# Altium schematic sheet AutomaticDeGenerator.SchDoc
size Letter
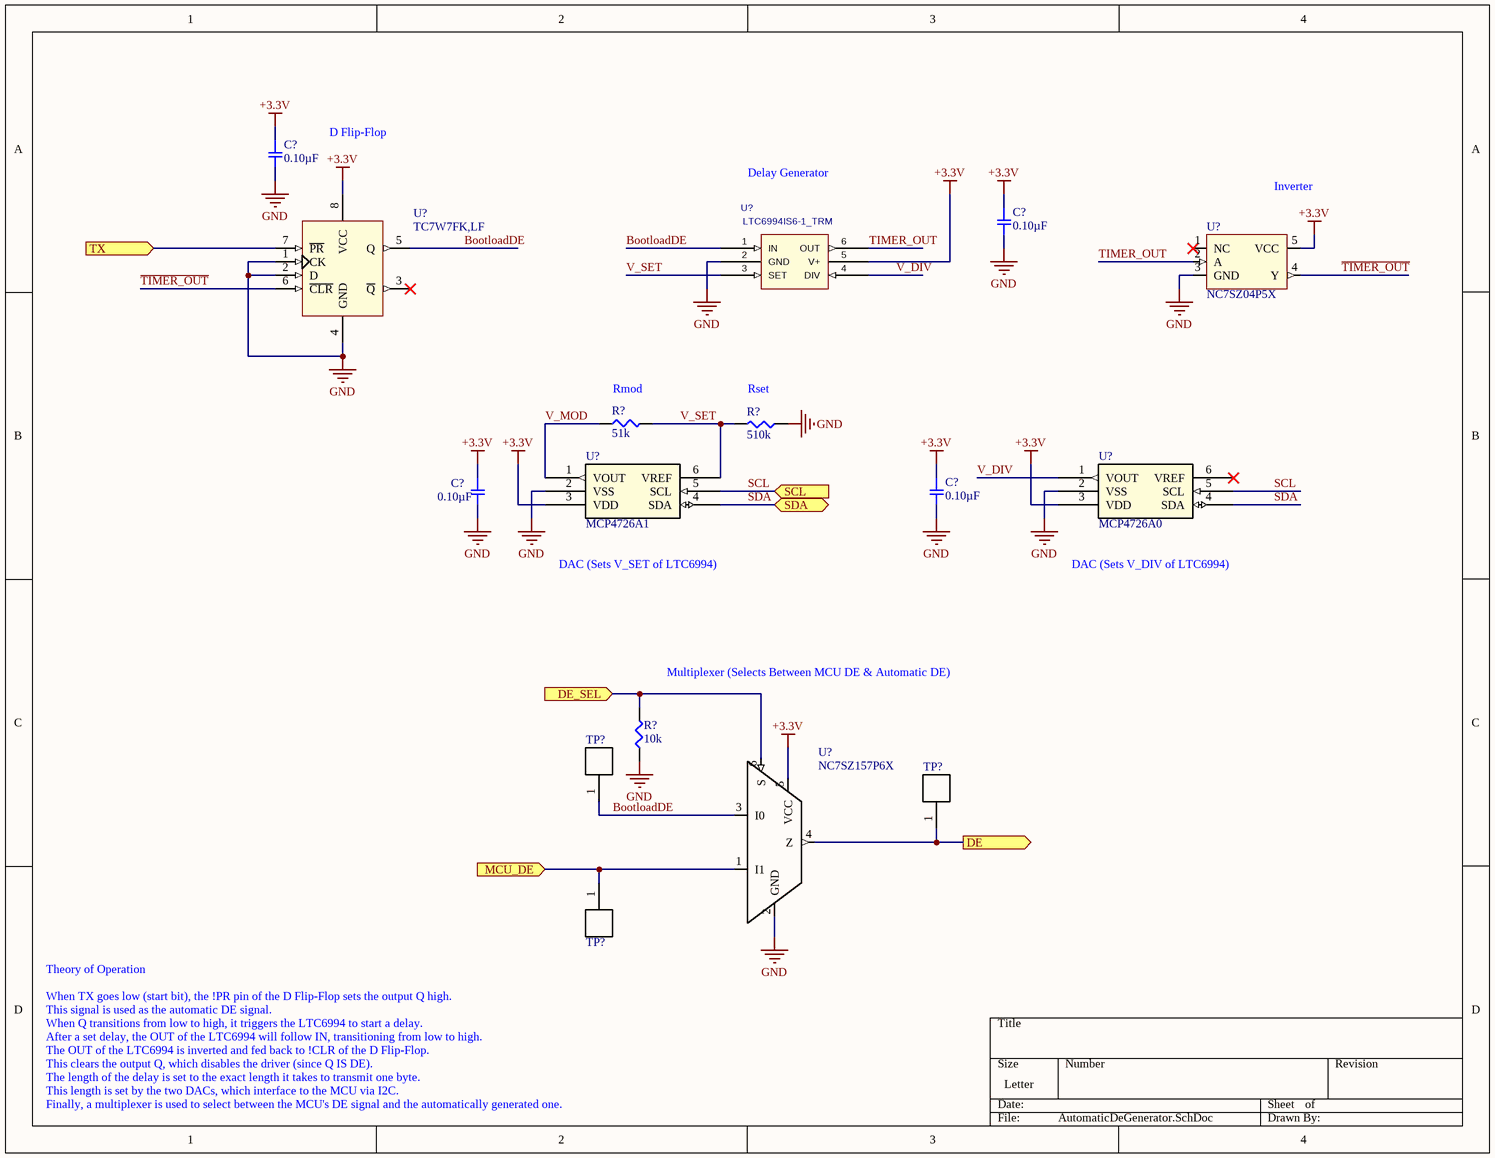
[diagram p0: AutomaticDeGenerator.SchDoc]

## Parts
(Parts that share a designator on the sheet are numbered #1, #2 ... from top to bottom, then left to right.)
C?#1  0.10µF  [SMD-0603C]
C?#2  0.10µF  [SMD-0603C]
C?#3  0.10µF  [SMD-0603C]
C?#4  0.10µF  [SMD-0603C]
R?#1  51k  [SMD-0603-RES]
R?#2  510k  [SMD-0603-RES]
R?#3  10k  [SMD-0603-RES]
TP?#1  BOOT_DE  [TE_RCU-0C]  (value not drawn)
TP?#2  DE  [TE_RCU-0C]  (value not drawn)
TP?#3  MCU_DE  [TE_RCU-0C]  (value not drawn)
U?#1  TC7W7FK,LF  [SSOP8-P-0.50A]
U?#2  LTC6994IS6-1_TRM  [TSOT-23_S6]
U?#3  NC7SZ04P5X  [SC-70-5]
U?#4  MCP4726A1  [SOT-23-6_MC]
U?#5  MCP4726A0  [SOT-23-6_MC]
U?#6  NC7SZ157P6X  [SC-70-6]

## Ports
DE (out), DE_SEL (in), MCU_DE (in), SCL (in), SDA (bidir), TX (in)

## Nets
+3.3V: C?#1.1 C?#2.1 C?#3.1 C?#4.1 U?#1.8(VCC) U?#2.5(V+) U?#3.5(VCC) U?#4.3(VDD) U?#5.3(VDD) U?#6.5(VCC)
GND: C?#1.2 C?#2.2 C?#3.2 C?#4.2 R?#2.1 R?#3.1 U?#1.1(CK) U?#1.2(D) U?#1.4(GND) U?#2.2(GND) U?#3.3(GND) U?#4.2(VSS) U?#5.2(VSS) U?#6.2(GND)
~{TIMER_OUT}: U?#1.6(~{CLR}) U?#3.4(Y)
BootloadDE: TP?#1.1 U?#1.5(Q) U?#2.1(IN) U?#6.3(I0)
DE: TP?#2.1 U?#6.4(Z) ; port DE
DE_SEL: R?#3.2 U?#6.6(S) ; port DE_SEL
MCU_DE: TP?#3.1 U?#6.1(I1) ; port MCU_DE
SCL: U?#4.5(SCL) U?#5.5(SCL) ; port SCL
SDA: U?#4.4(SDA) U?#5.4(SDA) ; port SDA
TIMER_OUT: U?#2.6(OUT) U?#3.2(A)
TX: U?#1.7(~{PR}) ; port TX
V_DIV: U?#2.4(DIV) U?#5.1(VOUT)
V_MOD: R?#1.1 U?#4.1(VOUT)
V_SET: R?#1.2 R?#2.2 U?#2.3(SET) U?#4.6(VREF)

Not connected (* = marked no-connect by the designer): U?#1 3(~{Q})*; U?#3 1(NC)*; U?#5 6(VREF)*

## Notes on the sheet
- D Flip-Flop
- Delay Generator
- Inverter
- (near R?#1) Rmod
- (near R?#2) Rset
- DAC (Sets V_SET of LTC6994)
- DAC (Sets V_DIV of LTC6994)
- (near R?#3) Multiplexer (Selects Between MCU DE & Automatic DE)
- Theory of Operation
- When TX goes low (start bit), the !PR pin of the D Flip-Flop sets the output Q high.
- This signal is used as the automatic DE signal.
- When Q transitions from low to high, it triggers the LTC6994 to start a delay.
- After a set delay, the OUT of the LTC6994 will follow IN, transitioning from low to high.
- The OUT of the LTC6994 is inverted and fed back to !CLR of the D Flip-Flop.
- This clears the output Q, which disables the driver (since Q IS DE).
- The length of the delay is set to the exact length it takes to transmit one byte.
- This length is set by the two DACs, which interface to the MCU via I2C.
- Finally, a multiplexer is used to select between the MCU's DE signal and the automatically generated one.

## Library data of the parts
C?#1-C?#4 = GCJ188R71C104KA01D: CAP CER 0.1UF 16V X7R 0603; Manufacturer: Murata Electronics North America; Factory Stock: 0; Unit Price (USD): 0.21; Minimum Quantity: 1; Tolerance: ±10%; Datasheets: http://www.murata.com/~/media/webrenewal/support/library/catalog/products/capacitor/mlcc/c03e.ashx; Image: //media.digikey.com/Renders/Murata%20Renders/0603%28LQG18%29.jpg; Digi-Key Part Number: 490-5796-1-ND; Part Number: GCJ188R71C104KA01D; Quantity Available: 22473; @ qty: 0; Packaging: Cut Tape (CT); Series: GCJ; Part Status: Active; Value: 0.10µF; Voltage: 16V; Temperature Coefficient: X7R; Operating Temperature: -55°C ~ 125°C; Features: Soft Termination; Ratings: AEC-Q200; Applications: Automotive, Boardflex Sensitive; Mounting Type: Surface Mount, MLCC; Package / Case: 0603 (1608 Metric); Size / Dimension: 0.063" L x 0.031" W (1.60mm x 0.80mm); Height - Seated (Max): -; Thickness (Max): 0.035" (0.90mm); Lead Spacing: -; Lead Style: -
R?#1 = ERJ-3EKF5102V: RES SMD 51K OHM 1% 1/10W 0603; Manufacturer: Panasonic Electronic Components; Factory Stock: 0; Unit Price (USD): 0.00379; @ qty: 1500; Minimum Quantity: 1; Power (Watts): 0.1W, 1/10W; Temperature Coefficient: ±100ppm/°C; Part Number: ERJ-3EKF5102V; Datasheets: http://industrial.panasonic.com/www-cgi/jvcr13pz.cgi?E+PZ+3+AOA0002+ERJ3EKF5102V+7+WW; Image: //media.digikey.com/Photos/Panasonic%20Photos/MFG_ERJ-P6W%20Series.jpg; Digi-Key Part Number: P51.0KHCT-ND; Quantity Available: 133930; Packaging: Cut Tape (CT); Series: ERJ; Part Status: Active; Value: 51k; Tolerance: ±1%; Composition: Thick Film; Features: Automotive AEC-Q200; Operating Temperature: -55°C ~ 155°C; Package / Case: 0603 (1608 Metric); Supplier Device Package: 0603; Size / Dimension: 0.063" L x 0.031" W (1.60mm x 0.80mm); Height - Seated (Max): 0.022" (0.55mm); Number of Terminations: 2; Failure Rate: -
R?#2 = ERJ-3EKF5103V: RES SMD 510K OHM 1% 1/10W 0603; Manufacturer: Panasonic Electronic Components; Factory Stock: 0; Unit Price (USD): 0.00379; @ qty: 1500; Minimum Quantity: 1; Power (Watts): 0.1W, 1/10W; Temperature Coefficient: ±100ppm/°C; Part Number: ERJ-3EKF5103V; Datasheets: http://industrial.panasonic.com/www-cgi/jvcr13pz.cgi?E+PZ+3+AOA0002+ERJ3EKF5103V+7+WW; Image: //media.digikey.com/Photos/Panasonic%20Photos/MFG_ERJ-P6W%20Series.jpg; Digi-Key Part Number: P510KHCT-ND; Quantity Available: 132059; Packaging: Cut Tape (CT); Series: ERJ; Part Status: Active; Value: 510k; Tolerance: ±1%; Composition: Thick Film; Features: Automotive AEC-Q200; Operating Temperature: -55°C ~ 155°C; Package / Case: 0603 (1608 Metric); Supplier Device Package: 0603; Size / Dimension: 0.063" L x 0.031" W (1.60mm x 0.80mm); Height - Seated (Max): 0.022" (0.55mm); Number of Terminations: 2; Failure Rate: -
R?#3 = ERJ-3EKF1002V: RES SMD 10K OHM 1% 1/10W 0603; Manufacturer: Panasonic Electronic Components; Factory Stock: 0; Unit Price (USD): 0.00379; @ qty: 1500; Minimum Quantity: 1; Power (Watts): 0.1W, 1/10W; Temperature Coefficient: ±100ppm/°C; Part Number: ERJ-3EKF1002V; Datasheets: http://industrial.panasonic.com/www-cgi/jvcr13pz.cgi?E+PZ+3+AOA0002+ERJ3EKF1002V+7+WW; Image: //media.digikey.com/Photos/Panasonic%20Photos/MFG_ERJ-P6W%20Series.jpg; Digi-Key Part Number: P10.0KHCT-ND; Quantity Available: 6703141; Packaging: Cut Tape (CT); Series: ERJ; Part Status: Active; Value: 10k; Tolerance: ±1%; Composition: Thick Film; Features: Automotive AEC-Q200; Operating Temperature: -55°C ~ 155°C; Package / Case: 0603 (1608 Metric); Supplier Device Package: 0603; Size / Dimension: 0.063" L x 0.031" W (1.60mm x 0.80mm); Height - Seated (Max): 0.022" (0.55mm); Number of Terminations: 2; Failure Rate: -
TP?#1-TP?#3 = RCU-0C: 0603 PROBE PAD; Power_Rating: 0 W; Resistance: <.05; MF: TE Connectivity; Tolerance: 0%; Digi-Key_Part_Number: A106145CT-ND; EU_RoHS_Compliance: Compliant; Digi-Key_Purchase_URL: https://www.digikey.com/product-detail/en/te-connectivity-amp-connectors/RCU-0C/A106145CT-ND/3477802?utm_source=snapeda&utm_medium=aggregator&utm_campaign=symbol; SnapEDA_Link: https://www.snapeda.com/parts/RCU-0C/TE%20Connectivity%20AMP%20Connectors/view-part/?ref=snap; Link: http://www.te.com/usa-en/product-1625854-3.html; MP: RCU-0C; Package: 0603; Value: *
U?#2 = LTC6994IS6-1_TRM: Manufacturer_Part_Number: LTC6994IS6-1#TRMPBF; Vendor: Linear Technology; Value: LTC6994IS6-1_TRM
U?#4 U?#5 = MCP4726Ax: Manufacturer_Part_Number: MCP4726A0T-E/CH; Vendor: Microchip; Built_By: EMA_UL_Team; C: Copyright (C) 2015 Accelerated Designs. All rights reserved; RefDes: RefDes; Type: DEV; Value: Value